# EAGLE design ComponentTester (EAGLE 9.6.2)
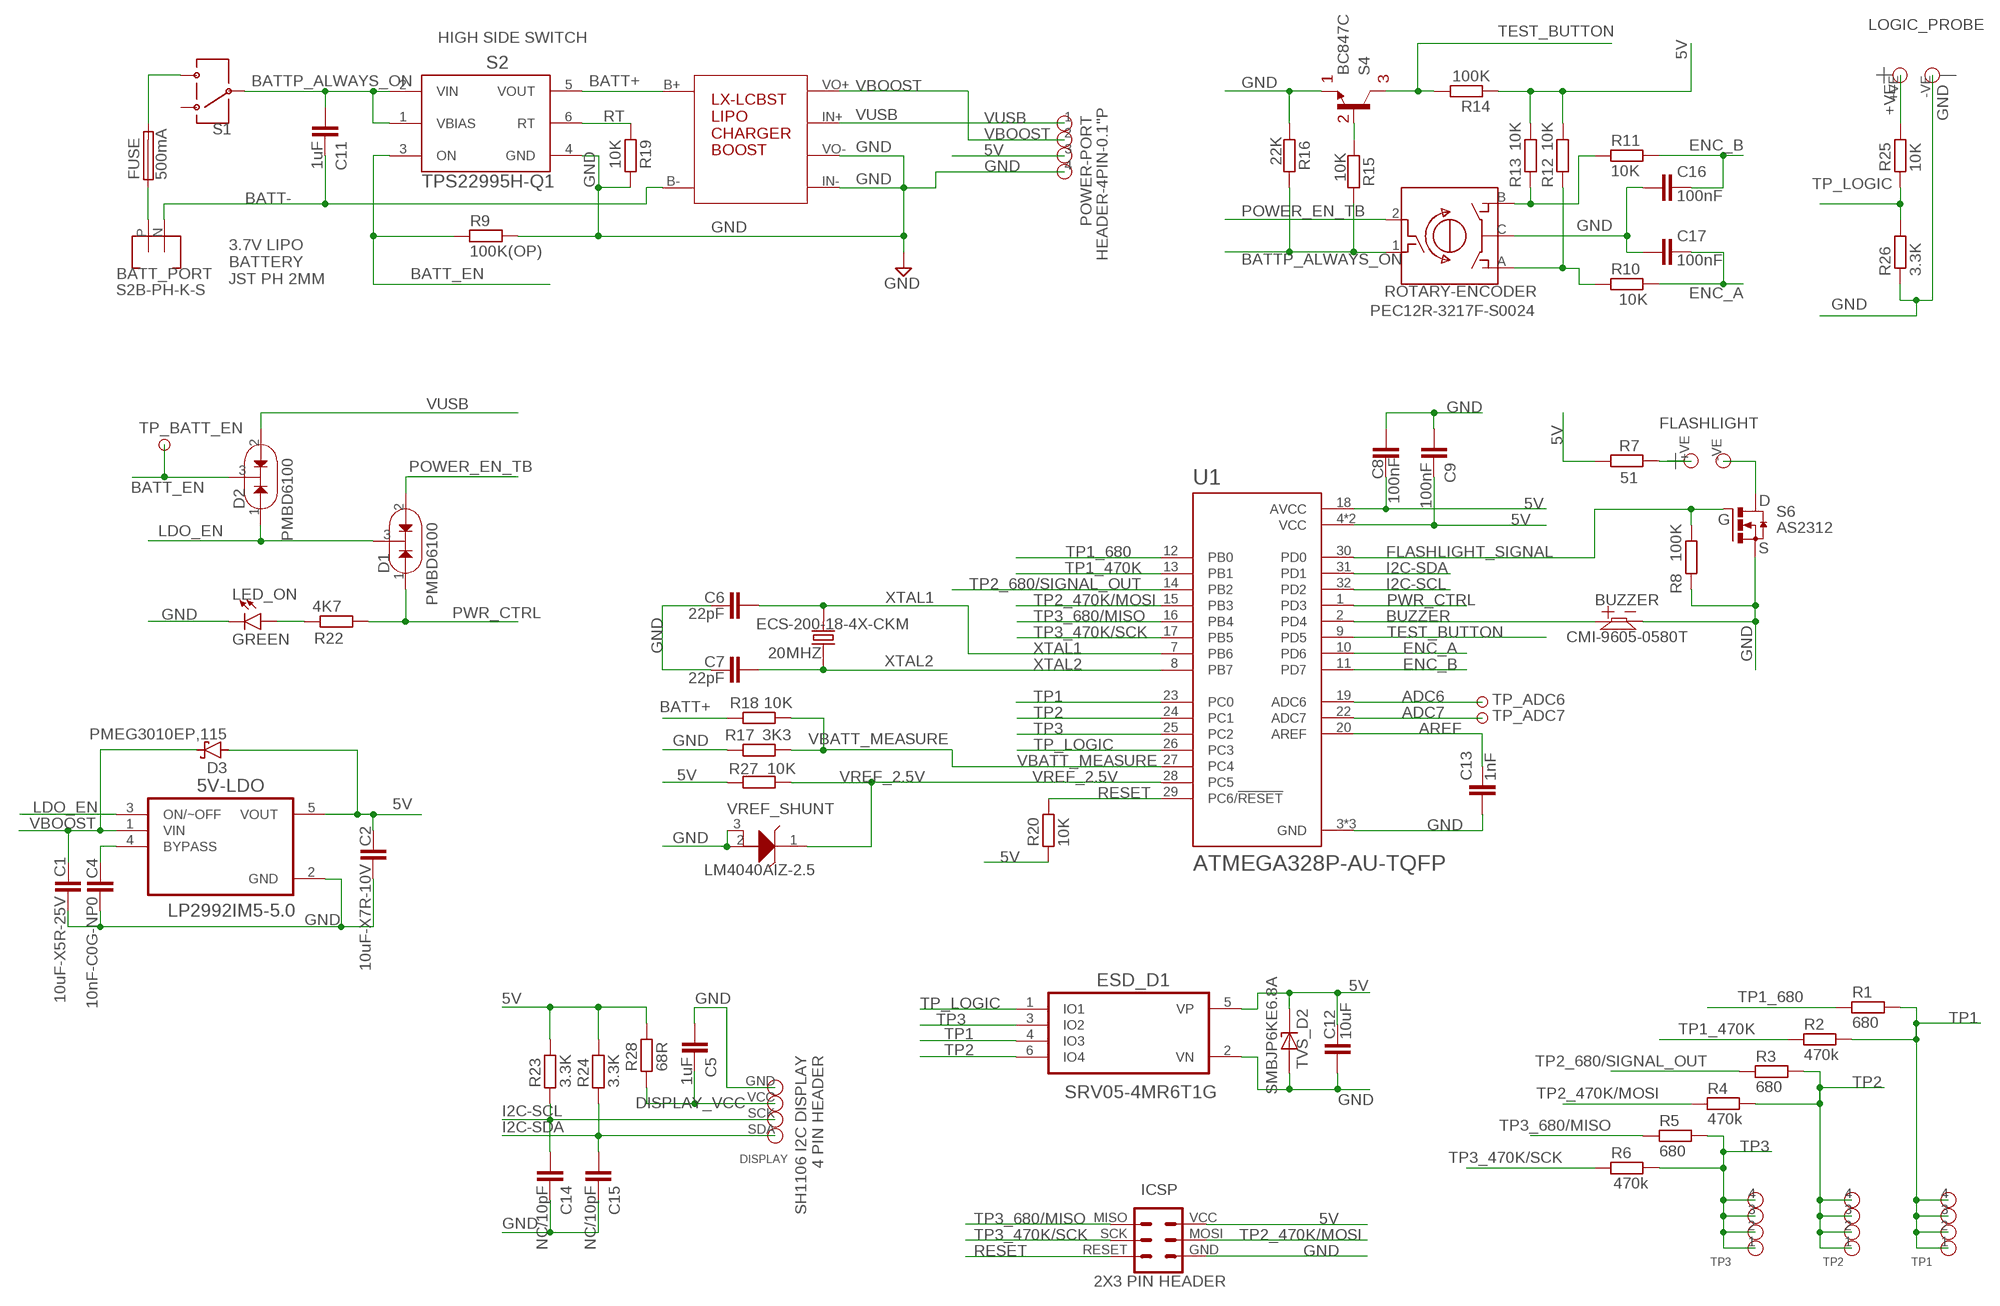
[diagram p0: schematic, sheet 1]

## Parts
5V-LDO  LP2992IM5-5.0  [SOT-23-5]
20MHZ  ECS-200-18-4X-CKM  CRYSTAL-20MHZ-ECS-200-18-4X-CKM  [XTAL_ECS-200-18-4X-CKM]
BATT_PORT  S2B-PH-K-S  [S2B-PH-K-S]
BUZZER  CMI-9605-0580T  BUZZER-ACTIVE-CMI-9605-0580T  [BUZZER-ACTIVE-CMI-9605-0580T]
C1  10uF-X5R-25V  CAPACITOR0603  [0603]
C2  10uF-X7R-10V  CAPACITOR0603  [0603]
C4  10nF-C0G-NP0  CAPACITOR_SMD0603  [0603]
C5  1uF  CAPACITOR_SMD0603  [0603]
C6  22pF  CAPACITOR_SMD0603  [0603]
C7  22pF  CAPACITOR_SMD0603  [0603]
C8  100nF  CAPACITOR_SMD0603  [0603]
C9  100nF  CAPACITOR_SMD0603  [0603]
C11  1uF  CAPACITOR_SMD0603  [0603]
C12  10uF  CAPACITOR_SMD0603  [0603]
C13  1nF  CAPACITOR_SMD0603  [0603]
C14  NC/10pF  CAPACITOR_SMD0603  [0603]
C15  NC/10pF  CAPACITOR_SMD0603  [0603]
C16  100nF  CAPACITOR_SMD0603  [0603]
C17  100nF  CAPACITOR_SMD0603  [0603]
CHARGE_BOOST  BATTERY-CHARGER-BOOST-MODULE-LX-LCBST  [BATTERY-CHARGER-BOOST-MODULE-LX-LCBST]
D1  PMBD6100  DIODE-DOUBLE-COMMON-CATHODE-PMBD6100,215  [SOT-23-3]
D2  PMBD6100  DIODE-DOUBLE-COMMON-CATHODE-PMBD6100,215  [SOT-23-3]
D3  PMEG3010EP,115  DIODE-SCHOTTKY-PMEG3010EP,115  [SOD-128]
DISPLAY  DISPLAY-1.3"-SH1106-I2C  [DISPLAY-1.3"-SH1106-I2C]
ESD_D1  SRV05-4MR6T1G  [SOT-23-6]
FLASHLIGHT  HEADER-2PIN-0.2"P  [HEADER-2PIN-0.2"P]
FUSE  500mA  FUSE  [1206]
ICSP  2X3 PIN HEADER  HEADER-ICSP-0.1"P  [HEADER-ICSP-0.1"P]
LED_ON  GREEN  LED1206  [1206-DIODE]
LOGIC_PROBE  HEADER-2PIN-0.2"P-LOGIC-PROBE  [HEADER-2PIN-0.2"P-LOGIC-PROBE]
POWER-PORT  HEADER-4PIN-0.1"P  [HEADER-4PIN-0.1"P]
R1  680  RESISTOR_SMD1206  [1206]
R2  470k  RESISTOR_SMD1206  [1206]
R3  680  RESISTOR_SMD1206  [1206]
R4  470k  RESISTOR_SMD1206  [1206]
R5  680  RESISTOR_SMD1206  [1206]
R6  470k  RESISTOR_SMD1206  [1206]
R7  51  RESISTOR_SMD1206  [1206]
R8  100K  RESISTOR_SMD0603  [0603]
R9  100K(OP)  RESISTOR_SMD0603  [0603]
R10  10K  RESISTOR_SMD0603  [0603]
R11  10K  RESISTOR_SMD0603  [0603]
R12  10K  RESISTOR_SMD0603  [0603]
R13  10K  RESISTOR_SMD0603  [0603]
R14  100K  RESISTOR_SMD0603  [0603]
R15  10K  RESISTOR_SMD0603  [0603]
R16  22K  RESISTOR_SMD0603  [0603]
R17  3K3  RESISTOR_SMD0603  [0603]
R18  10K  RESISTOR_SMD0603  [0603]
R19  10K  RESISTOR_SMD0603  [0603]
R20  10K  RESISTOR_SMD0603  [0603]
R22  4K7  RESISTOR_SMD0603  [0603]
R23  3.3K  RESISTOR_SMD0603  [0603]
R24  3.3K  RESISTOR_SMD0603  [0603]
R25  10K  RESISTOR_SMD0603  [0603]
R26  3.3K  RESISTOR_SMD0603  [0603]
R27  10K  RESISTOR_SMD0603  [0603]
R28  68R  RESISTOR_SMD0603  [0603]
ROTARY-ENCODER  PEC12R-3217F-S0024  [PEC12R-3217F-S0024]
S1  SLW-913535-2A-RA-D  [SLW-913535-2A-RA-D]
S2  TPS22995H-Q1  [SOT-23-6]
S4  BC847C  [SOT-23-3]
S6  AS2312  AS2312AS2312  [SOT-23-3]
TP1  HEADER-4PIN-0.1"P  [HEADER-4PIN-0.1"P]
TP2  HEADER-4PIN-0.1"P  [HEADER-4PIN-0.1"P]
TP3  HEADER-4PIN-0.1"P  [HEADER-4PIN-0.1"P]
TP_ADC6  TEST-POINT-TH  [TEST-POINT-TH-1MM]
TP_ADC7  TEST-POINT-TH  [TEST-POINT-TH-1MM]
TP_BATT_EN  TEST-POINT-SMD  [TEST-POINT-SMD-1MM]
TVS_D2  SMBJP6KE6.8A  SMBJP6KE6.8A-TP  [DIOM5336X244N]
U1  ATMEGA328P-AU-TQFP  [TQFP32]
VREF_SHUNT  LM4040AIZ-2.5  LM4040AELT-2.5-SOT23  [SOT-23-3]

## Nets
5V: 5V-LDO.5(VOUT) C2.2 C8.2 C9.1 C12.1 D3.A ESD_D1.5(VP) ICSP.VCC POWER-PORT.3 R7.1 R12.2 R13.2 R14.1 R20.1 R23.2 R24.2 R27.1 R28.2 TVS_D2.C U1.4(VCC) U1.6(VCC) U1.18(AVCC)
+VE: LOGIC_PROBE.+VE R25.2
ADC6: TP_ADC6.P$1 U1.19(ADC6)
ADC7: TP_ADC7.P$1 U1.22(ADC7)
AREF: C13.1 U1.20(AREF)
BATT+: CHARGE_BOOST.B+ R18.2 S2.5(VOUT)
BATT+_PORT: BATT_PORT.P FUSE.1
BATT-: BATT_PORT.N C11.1 CHARGE_BOOST.B-
BATT_EN: D2.3(C) R9.1 S2.3(ON) TP_BATT_EN.P$1
BATTP_ALWAYS_ON: C11.2 ROTARY-ENCODER.2 S1.2 S2.1(VBIAS) S2.2(VIN)
BUZZER: BUZZER.P$1 U1.2(PD4)
BYP: 5V-LDO.4(BYPASS) C4.2
DISPLAY_VCC: C5.1 DISPLAY.VCC R28.1
ENC_A: C17.1 R10.2 U1.10(PD6)
ENC_B: C16.1 R11.2 U1.11(PD7)
FLASHLIGHT_SIGNAL: R8.1 S6.1(G) U1.30(PD0)
FUSE_2_SWITCH: FUSE.2 S1.3
GND [New Class]: 5V-LDO.2(GND) BUZZER.P$2 C1.1 C2.1 C4.1 C5.2 C6.1 C7.1 C8.1 C9.2 C12.2 C13.2 C14.1 C15.1 C16.2 C17.2 CHARGE_BOOST.IN-(USB-) CHARGE_BOOST.VO- DISPLAY.GND ESD_D1.2(VN) ICSP.GND LED_ON.C LOGIC_PROBE.-VE POWER-PORT.4 R8.2 R9.2 R16.1 R17.1 R19.2 R26.1 ROTARY-ENCODER.C S2.4(GND) S4.2(E) S6.2(S) TVS_D2.A U1.3(GND) U1.5(GND) U1.21(GND) VREF_SHUNT.2(A) VREF_SHUNT.3(NC/A)
I2C-SCL: C14.2 DISPLAY.SCK R23.1 U1.32(PD2)
I2C-SDA: C15.2 DISPLAY.SDA R24.1 U1.31(PD1)
LDO_EN: 5V-LDO.3(ON/~OFF) D1.3(C) D2.1(A1)
N$1: R11.1 R13.1 ROTARY-ENCODER.B
N$3: FLASHLIGHT.-VE S6.3(D)
N$4: R10.1 R12.1 ROTARY-ENCODER.A
N$5: R15.1 S4.1(B)
N$8: FLASHLIGHT.+VE R7.2
POWER_EN_TB: D1.2(A2) R15.2 R16.2 ROTARY-ENCODER.1
PWR_CTRL: D1.1(A1) R22.2 U1.1(PD3)
RESET: ICSP.RESET R20.2 U1.29(PC6/!RESET)
RT: R19.1 S2.6(RT)
TEST_BUTTON: R14.2 S4.3(C) U1.9(PD5)
TO_LED: LED_ON.A R22.1
TP1: ESD_D1.4(IO3) R1.2 R2.2 TP1.1 TP1.2 TP1.3 TP1.4 U1.23(PC0)
TP1_470K: R2.1 U1.13(PB1)
TP1_680: R1.1 U1.12(PB0)
TP2: ESD_D1.6(IO4) R3.2 R4.2 TP2.1 TP2.2 TP2.3 TP2.4 U1.24(PC1)
TP2_470K/MOSI: ICSP.MOSI R4.1 U1.15(PB3)
TP2_680/SIGNAL_OUT: R3.1 U1.14(PB2)
TP3: ESD_D1.3(IO2) R5.2 R6.2 TP3.1 TP3.2 TP3.3 TP3.4 U1.25(PC2)
TP3_470K/SCK: ICSP.SCK R6.1 U1.17(PB5)
TP3_680/MISO: ICSP.MISO R5.1 U1.16(PB4)
TP_LOGIC: ESD_D1.1(IO1) R25.1 R26.2 U1.26(PC3)
VBATT_MEASURE: R17.2 R18.1 U1.27(PC4)
VBOOST: 5V-LDO.1(VIN) C1.2 CHARGE_BOOST.VO+ D3.K(C) POWER-PORT.2
VREF_2.5V: R27.2 U1.28(PC5) VREF_SHUNT.1(C)
VUSB: CHARGE_BOOST.IN+(USB+) D2.2(A2) POWER-PORT.1
XTAL1: 20MHZ.2 C6.2 U1.7(PB6)
XTAL2: 20MHZ.1 C7.2 U1.8(PB7)
Unconnected: S1.1

## Notes on the sheet
- HIGH SIDE SWITCH
- 3.7V LIPO
  BATTERY
  JST PH 2MM

## Library data of the parts
5V-LDO = .MyComponents:LP2992IM5-5.0: Check availability <https://pricing.snapeda.com/parts/LP2992IM5-5.0/NOPB/Texas%20Instruments/view-part?ref=eda>; AVAILABILITY: In Stock; CHECK_PRICES: https://www.snapeda.com/parts/LP2992IM5-5.0/NOPB/Texas+Instruments/view-part/?ref=eda; DESCRIPTION: 250-mA, 16-V, low-dropout voltage regulator with enable; MF: Texas Instruments; MP: LP2992IM5-5.0/NOPB; PACKAGE: SOT-23-5 Texas Instruments; PRICE: None; PURCHASE-URL: https://www.snapeda.com/api/url_track_click_mouser/?unipart_id=26545&manufacturer=Texas Instruments&part_name=LP2992IM5-5.0/NOPB&search_term=lp2992im5-5.0/nopb; SNAPEDA_LINK: https://www.snapeda.com/parts/LP2992IM5-5.0/NOPB/Texas+Instruments/view-part/?ref=snap
20MHZ = .MyComponents:CRYSTAL-20MHZ-ECS-200-18-4X-CKM: 20MHz Crystal Check availability <https://pricing.snapeda.com/parts/ECS-200-18-4X-CKM/ECS%20Inc./view-part?ref=eda>; AVAILABILITY: In Stock; CHECK_PRICES: https://www.snapeda.com/parts/ECS-200-18-4X-CKM/ECS+Inc./view-part/?ref=eda; DATASHEET: https://ecsxtal.com/store/pdf/hc-49usx.pdf; DESCRIPTION: 20 MHz ±10ppm Crystal 18pF 30 Ohms HC-49/US; MF: ECS Inc.; MP: ECS-200-18-4X-CKM; PACKAGE: HC-49US ECS Inc.; PRICE: None; PURCHASE-URL: https://www.snapeda.com/api/url_track_click_mouser/?unipart_id=5049327&manufacturer=ECS Inc.&part_name=ECS-200-18-4X-CKM&search_term=None; SNAPEDA_LINK: https://www.snapeda.com/parts/ECS-200-18-4X-CKM/ECS+Inc./view-part/?ref=snap
BATT_PORT = .MyComponents:S2B-PH-K-S: S2B-PH-K-S JST 2 PIN CONNECTOR RIGHT ANGLE https://www.digikey.com/en/products/detail/jst-sales-america-inc/S2B-PH-K-S/926626
BUZZER = .MyComponents:BUZZER-ACTIVE-CMI-9605-0580T: Active Buzzer WST-0905T https://www.digikey.com/en/products/detail/soberton-inc/WST-0905T/16354847; DATASHEET: https://www.mouser.com/datasheet/2/670/cmi_9605_0580t-1776530.pdf
C1 C2 = .MyComponents:CAPACITOR0603: capacitor 0603
C4-C9 C11-C17 = .MyComponents:CAPACITOR_SMD: capacitor 1206
CHARGE_BOOST = .MyComponents:BATTERY-CHARGER-BOOST-MODULE-LX-LCBST: LX-LCBST_LIPO_CHARGER_BOOST https://www.aliexpress.us/item/3256805102704359.html
D1 D2 = .MyComponents:DIODE-DOUBLE-COMMON-CATHODE-PMBD6100,215: Dual diode common cathode https://www.mouser.com/ProductDetail/Nexperia/PMBD6100215; DATASHEET: https://www.mouser.com/datasheet/2/916/PMBD6100-2938376.pdf; VALUE: PMBD6100,215
D3 = .MyComponents:DIODE-SCHOTTKY-PMEG3010EP,115: Diode 30 V 1A Surface Mount SOD-128/CFP5 Nexperia USA Inc. https://www.digikey.com/en/products/detail/nexperia-usa-inc/PMEG3010EP-115/2676893
DISPLAY = .MyComponents:DISPLAY-1.3"-SH1106-I2C: SH1106 I2C DISPLAY https://www.amazon.com/dp/B0C3L54TL6
ESD_D1 = .MyComponents:SRV05-4MR6T1G: ESD Circuit Protection 17.5V Clamp 5A (8/20µs) Ipp Tvs Diode Surface Mount 6-TSOP DigiKey <https://www.digikey.com/en/products/detail/onsemi/SRV05-4MR6T1G/2652020> Check availability <https://pricing.snapeda.com/parts/SRV05-4MR6T1G/ON%20Semiconductor/view-part?ref=eda>; AVAILABILITY: In Stock; CHECK_PRICES: https://www.snapeda.com/parts/SRV05-4MR6T1G/Onsemi/view-part/?ref=eda; DESCRIPTION: 17.5V Clamp 5A (8/20µs) Ipp Tvs Diode Surface Mount 6-TSOP; MF: ON Semiconductor; MP: SRV05-4MR6T1G; PACKAGE: TSOP-6 ON Semiconductor; PRICE: None; PURCHASE-URL: https://www.snapeda.com/api/url_track_click_mouser/?unipart_id=95760&manufacturer=ON Semiconductor&part_name=SRV05-4MR6T1G&search_term=None; SNAPEDA_LINK: https://www.snapeda.com/parts/SRV05-4MR6T1G/Onsemi/view-part/?ref=snap
FLASHLIGHT = .MyComponents:HEADER-2PIN-0.2"P: 5MM 2 PIN HEADER
FUSE = .MyComponents:FUSE: FUSE SMD 1206 C1F 250
ICSP = .MyComponents:HEADER-ICSP-0.1"P: ISP HEADER 2X3 2.54MM
LED_ON = .MyComponents:LED
LOGIC_PROBE = .MyComponents:HEADER-2PIN-0.2"P-LOGIC-PROBE: 5MM 2 PIN HEADER
POWER-PORT TP1-TP3 = .MyComponents:HEADER-4PIN-0.1"P: 4 PIN HEADER; LOCATION: <enter>
R1-R20 R22-R28 = .MyComponents:RESISTOR_SMD: resistor smd
ROTARY-ENCODER = .MyComponents:PEC12R-3217F-S0024: Rotary Encoder with Push Button and Bushing Bourns Inc digikey <https://www.digikey.com/en/products/detail/bourns-inc/PEC12R-3217F-S0024/6153383>
S1 = .MyComponents:SLW-913535-2A-RA-D: spdt slide switch
S2 = .MyComponents:TPS22995H-Q1: Power Switch/Driver 1:1 N-Channel 3A SOT-23-THIN DigiKey <https://www.digikey.com/en/products/detail/texas-instruments/TPS22995HQDDCRQ1/17394924>
S4 = .MyComponents:BC847C: BC847C Bipolar (BJT) Transistor NPN 45 V 100 mA 300MHz 200 mW Surface Mount SOT-23 https://www.digikey.com/en/products/detail/good-ark-semiconductor/BC847C/18648944
S6 = .MyComponents:AS2312: AS2312 N-Channel 20 V 6.8A (Ta) 1.2W (Ta) Surface Mount SOT-23 https://www.digikey.com/en/products/detail/anbon-semiconductor-int-l-limited/AS2312/16708465
TP_ADC6 TP_ADC7 TP_BATT_EN = .MyComponents:TEST-POINT: TEST POINT
TVS_D2 = .MyComponents:SMBJP6KE6.8A-TP: SMBJ Series 600 W 6.8 V Uni-Directional Surface Mount TVS Diode - SMB; CHECK_PRICES: https://www.snapeda.com/parts/SMBJP6KE6.8A-TP/Micro+Commercial+Components/view-part/?ref=eda; DESCRIPTION: 10.5V Clamp 58.1A Ipp Tvs Diode Surface Mount DO-214AA (SMBJ); DIGIKEY_PART_NUMBER: SMBJP6KE6.8A-TPMSTR-ND; MF: Micro Commercial; MP: SMBJP6KE6.8A-TP; PACKAGE: DO-214 MCC; PURCHASE-URL: https://www.snapeda.com/api/url_track_click_mouser/?unipart_id=577204&manufacturer=Micro Commercial&part_name=SMBJP6KE6.8A-TP&search_term=smbjp6ke6.8a; SNAPEDA_LINK: https://www.snapeda.com/parts/SMBJP6KE6.8A-TP/Micro+Commercial+Components/view-part/?ref=snap
U1 = .MyComponents:ATMEGA328P-AU-TQFP: Check availability <https://pricing.snapeda.com/parts/ATMEGA328P-AU/Microchip/view-part?ref=eda>; AVAILABILITY: In Stock; CHECK_PRICES: https://www.snapeda.com/parts/ATMEGA328P-AU/Microchip/view-part/?ref=eda; DESCRIPTION: AVR AVR® ATmega Microcontroller IC 8-Bit 20MHz 32KB (16K x 16) FLASH 32-TQFP (7x7); MF: Microchip; MP: ATMEGA328P-AU; PACKAGE: TQFP-32 Microchip; PRICE: None; PURCHASE-URL: https://www.snapeda.com/api/url_track_click_mouser/?unipart_id=44280&manufacturer=Microchip&part_name=ATMEGA328P-AU&search_term=atmega328p-au; SNAPEDA_LINK: https://www.snapeda.com/parts/ATMEGA328P-AU/Microchip/view-part/?ref=snap
VREF_SHUNT = .MyComponents:LM4040AELT-2.5-SOT23: STMicroelectronics Shunt Voltage Reference IC Fixed 2.5V V ±0.1% 15 mA SOT-23-3 https://www.digikey.com/en/products/detail/stmicroelectronics/LM4040AELT-2-5/16184070 https://www.mouser.com/ProductDetail/511-LM4040AELT-2.5; DATASHEET: https://www.st.com/resource/en/datasheet/lm4040.pdf

## Net classes
0 default: clearance 0.205 mm

## Board
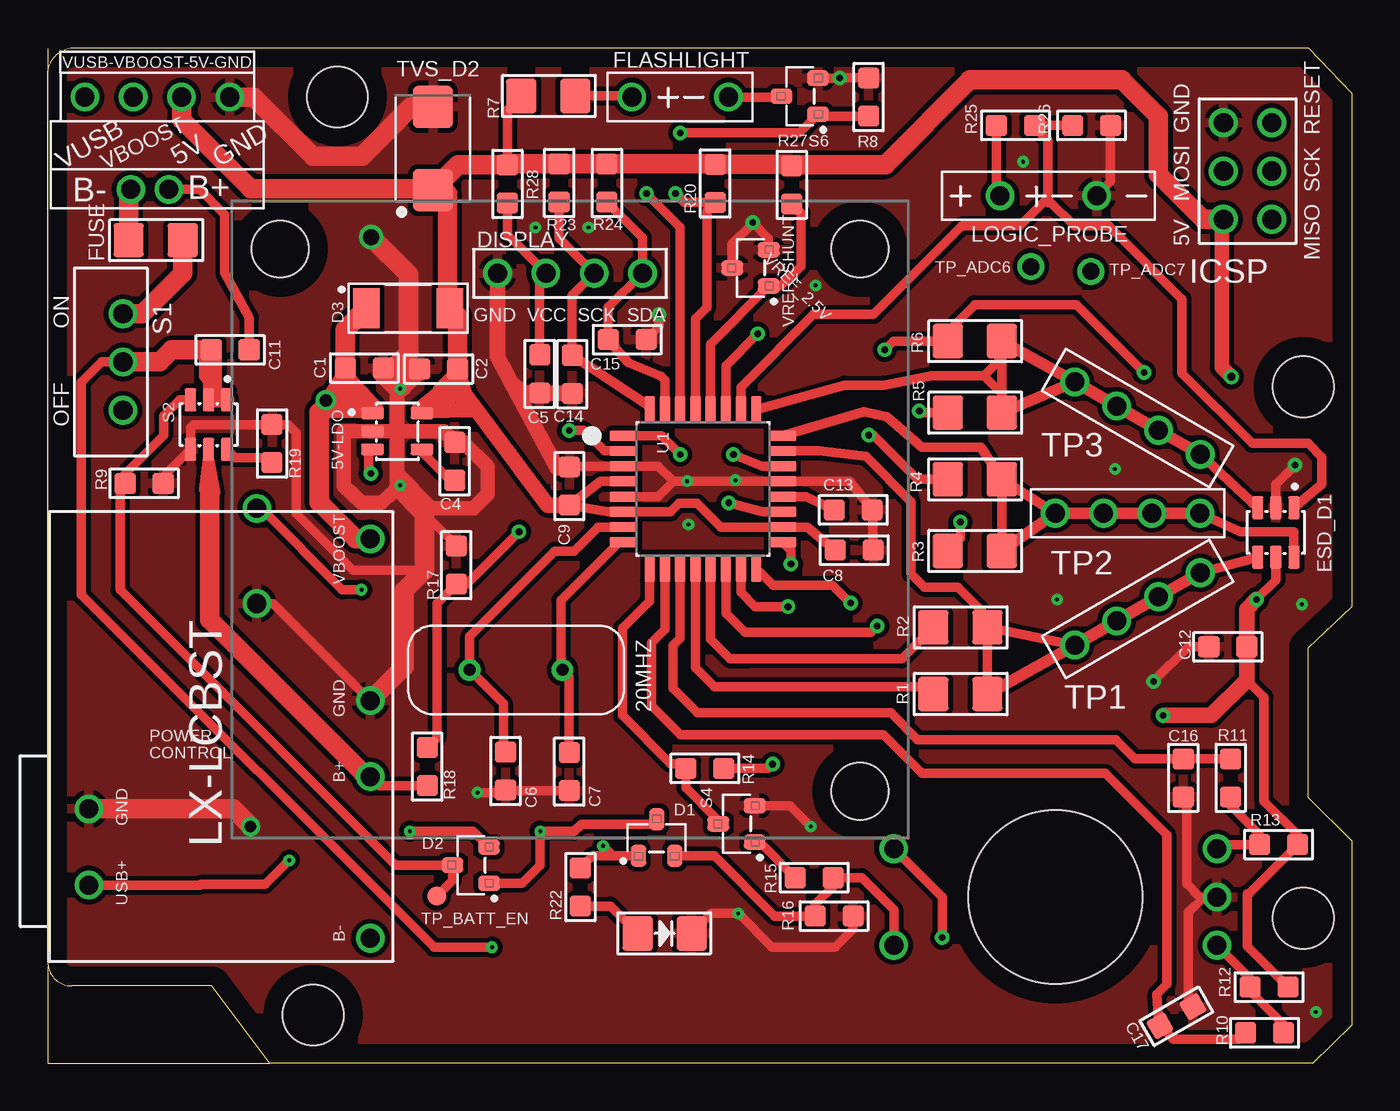
[diagram p1: board, top side]
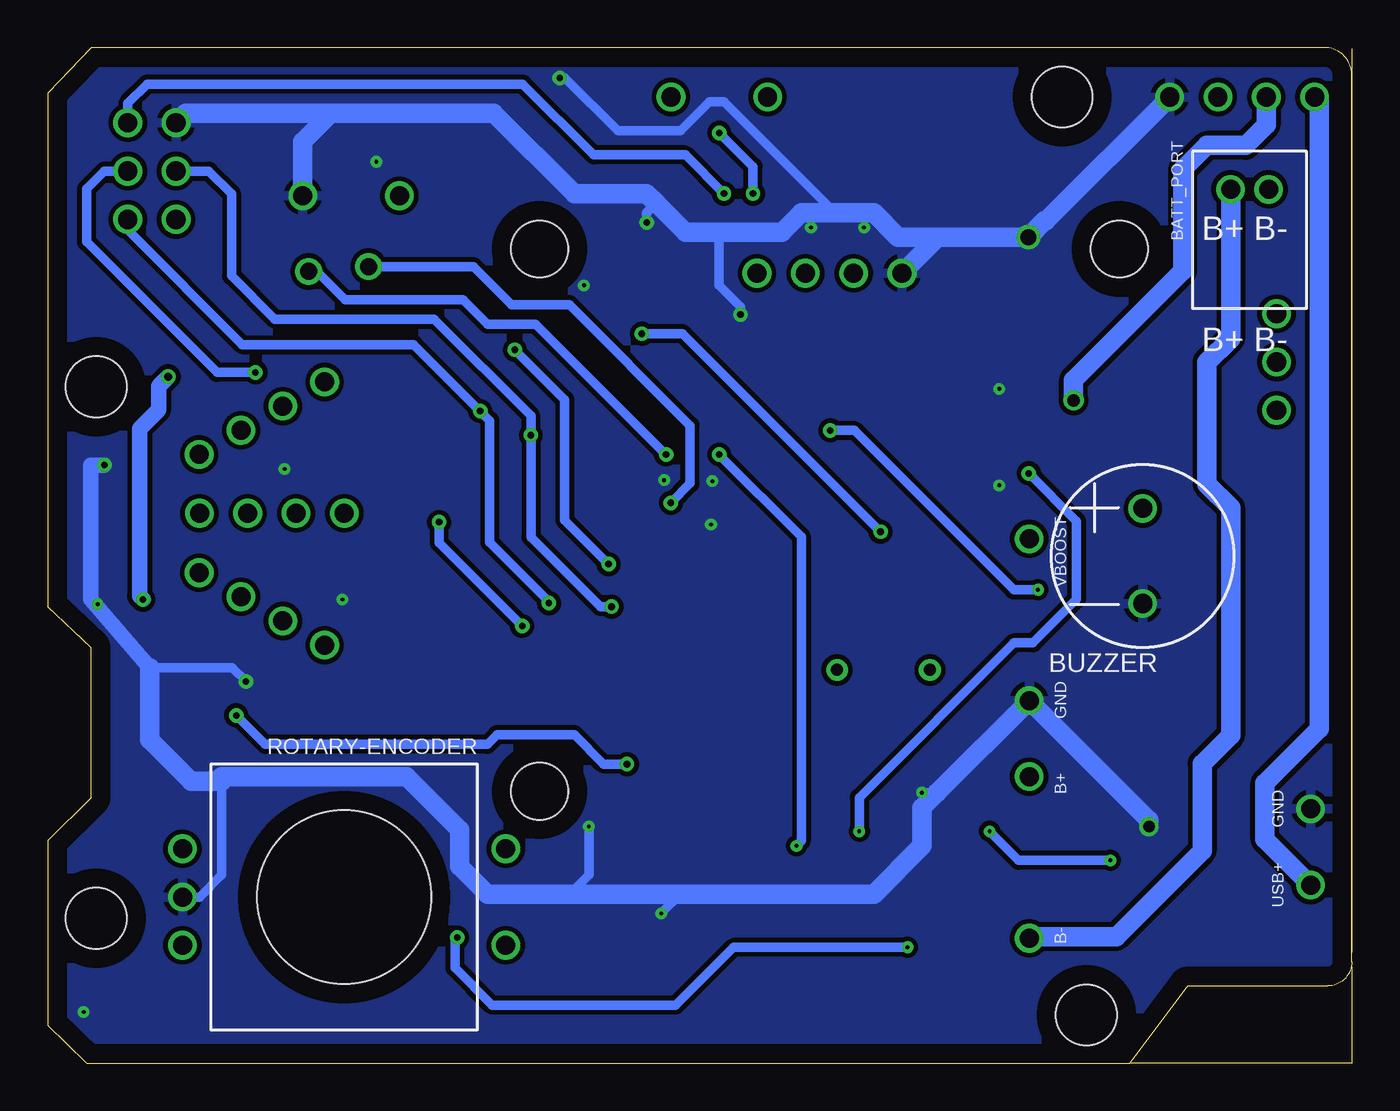
[diagram p2: board, bottom side, seen from below]

Size 68.61 x 53.4 mm. Coordinates in mm from the lower left corner, seen from the top.
Outline: 11.69,0 0.01,0 0.01,4.83 0.01,5.08
Outline: 0.01,53.34 0.01,53.09 0.01,52.07 0.01,51.82
Outline: 0.01,51.82 0.01,51.31 0.01,5.84
Outline: 0.01,51.82 0.01,5.33 arc90 1.28,4.06 8.64,4.06 11.69,0
Outline: 11.69,0 66.55,0 68.61,2 68.61,11.7 66.3,13.97 66.3,21.84 68.61,24 68.61,51 66.31,53.4 1.51,53.4 arc98 0.01,51.82
Copper layers (1*16): Top 0.035mm / dielectric 1.5mm / Bottom 0.035mm
Design rules "default *": minimum track width 0.5mm, minimum drill 0.2mm, track to track 0.25mm, track to pad 0.25mm, pad to pad 0.25mm, via to via 0.25mm, smd to smd 6mil, copper to edge 1mm, drill to drill 0.5mm, minimum pad ring 10mil, minimum via ring 8mil, stop-mask expansion 0.25mm, vias tented up to drill 0mil, thermal gap 10mil
Holes 3.2 mm at 13.98,2.54 66.05,7.62 66.05,35.56 15.25,50.8
tKeepout: area 64,5.6 to 68,9.6; area 64,33.6 to 68,37.6; area 12,0.5 to 16,4.5; area 13.2,48.8 to 17.2,52.8
bKeepout: area 64,33.6 to 68,37.6; area 64,5.6 to 68,9.6; area 12,0.5 to 16,4.5; area 13.2,48.8 to 17.2,52.8

### Footprints (pad centres in the part's own frame; a part is rotated, then mirrored left to right if it is on the bottom)
SOT-23-5 = smd 1.2 x 0.6: 1 -1.3,0.95; 2 -1.3,0; 3 -1.3,-0.95; 4 1.3,-0.95; 5 1.3,0.95
XTAL_ECS-200-18-4X-CKM = drill 0.63 pad 1.03: 1 -2.44,0; 2 2.44,0
S2B-PH-K-S = drill 1: N 0.984,-2.54; P -1.016,-2.54
BUZZER-ACTIVE-CMI-9605-0580T = drill 1: P$1 0,2.5; P$2 0,-2.5
0603 = smd 1.1 x 1.1: 1 -1,0; 2 1,0
BATTERY-CHARGER-BOOST-MODULE-LX-LCBST = drill 1: B+ -1.73,-7.69; B- -10.23,-7.69; IN+ -7.43,7.11; IN- -3.43,7.11; VO+ 10.77,-7.69; VO- 2.27,-7.69
SOT-23-3 = smd 0.8 x 1.13: 1 -0.95,-0.96; 2 0.95,-0.96; 3 0,0.96
SOD-128 = smd 1.4 x 2.1: A 2.11,0.06; K -2.29,0.06
DISPLAY-1.3"-SH1106-I2C = drill 1: GND -3.81,-1.27; SCK 1.27,-1.27; SDA 3.81,-1.27; VCC -1.27,-1.27 | hole 3: -15.24,0; 15.24,0; 15.24,-28.5
SOT-23-6 = smd 1.2 x 0.6: 1 -1.3,0.95; 2 -1.3,0; 3 -1.3,-0.95; 4 1.3,-0.95; 5 1.3,0; 6 1.3,0.95
HEADER-2PIN-0.2"P = drill 1: +VE -2.54,0; -VE 2.54,0
1206 = smd 1.6 x 1.803: 1 -1.422,0; 2 1.422,0
HEADER-ICSP-0.1"P = drill 1.016: GND 2.54,1.27; MISO -2.54,-1.27; MOSI 0,1.27; RESET 2.54,-1.27; SCK 0,-1.27; VCC -2.54,1.27
1206-DIODE = smd 1.6 x 1.803: A 1.422,0; C -1.422,0
HEADER-2PIN-0.2"P-LOGIC-PROBE = drill 1: +VE -2.54,0; -VE 2.54,0
HEADER-4PIN-0.1"P = drill 1: 1 -3.81,0; 2 -1.27,0; 3 1.27,0; 4 3.81,0
PEC12R-3217F-S0024 = drill 1: 1 -2.54,8.5; 2 2.54,8.5; A -2.54,-8.5; B 2.54,-8.5; C 0,-8.5 | hole 9.144: 0,0
SLW-913535-2A-RA-D = drill 1: 1 -2.54,0; 2 0,0; 3 2.54,0
TEST-POINT-TH-1MM = drill 0.9: P$1 0,0
TEST-POINT-SMD-1MM = smd 1 x 1: P$1 0,0
DIOM5336X244N = smd 2.22 x 2.13: A 2.19,0; C -2.19,0
TQFP32 = smd 1.47 x 0.55: 1 -4.17,2.8; 2 -4.17,2; 3 -4.17,1.2; 4 -4.17,0.4; 5 -4.17,-0.4; 6 -4.17,-1.2; 7 -4.17,-2; 8 -4.17,-2.8; 17 4.17,-2.8; 18 4.17,-2; 19 4.17,-1.2; 20 4.17,-0.4; 21 4.17,0.4; 22 4.17,1.2; 23 4.17,2; 24 4.17,2.8 | smd 0.55 x 1.47: 9 -2.8,-4.17; 10 -2,-4.17; 11 -1.2,-4.17; 12 -0.4,-4.17; 13 0.4,-4.17; 14 1.2,-4.17; 15 2,-4.17; 16 2.8,-4.17; 25 2.8,4.17; 26 2,4.17; 27 1.2,4.17; 28 0.4,4.17; 29 -0.4,4.17; 30 -1.2,4.17; 31 -2,4.17; 32 -2.8,4.17

### Placement (x,y rotation side)
5V-LDO  18.4,33.22 0 top
20MHZ  24.64,20.68 180 top
BATT_PORT  5.4,43.4 180 bottom
BUZZER  11.01,26.67 0 bottom
C1  16.66,36.55 180 top
C2  20.57,36.49 0 top
C4  21.42,31.65 270 top
C5  25.89,36.25 270 top
C6  24.09,15.36 90 top
C7  27.44,15.33 90 top
C8  42.43,26.98 180 top
C9  27.44,30.34 90 top
C11  9.61,37.51 180 top
C12  62.08,21.89 180 top
C13  42.38,29.09 0 top
C14  27.59,36.22 90 top
C15  30.49,38.05 180 top
C16  59.74,15 270 top
C17  59.38,2.46 30 top
CHARGE_BOOST  9.29,16.8 90 top
D1  32.04,11.87 0 top
D2  22.25,10.42 90 top
D3  19.06,39.62 0 top
DISPLAY  27.48,42.81 0 top
ESD_D1  64.6,27.91 270 top
FLASHLIGHT  33.27,50.8 0 top
FUSE  5.69,43.28 0 top
ICSP  63.12,46.91 90 top
LED_ON  32.46,6.82 180 top
LOGIC_PROBE  52.64,45.61 0 top
POWER-PORT  5.78,50.8 0 top
R1  48.01,19.41 0 top
R2  48.01,22.92 0 top
R3  48.77,26.94 0 top
R4  48.77,30.7 0 top
R5  48.77,34.21 0 top
R6  48.77,37.97 0 top
R7  26.33,50.86 0 top
R8  43.19,50.8 90 top
R9  5.09,30.48 0 top
R10  64.01,1.6 180 top
R11  62.23,15 90 top
R12  64.24,4 0 top
R13  64.75,11.49 0 top
R14  34.57,15.5 180 top
R15  40.32,9.75 0 top
R16  41.37,7.74 180 top
R17  21.49,26.19 270 top
R18  19.97,15.6 270 top
R19  11.8,32.58 90 top
R20  35.11,46.25 270 top
R22  28.03,9.26 90 top
R23  26.9,46.28 90 top
R24  29.42,46.28 90 top
R25  50.91,49.31 180 top
R26  54.91,49.31 180 top
R27  39.15,46.18 270 top
R28  24.19,46.23 90 top
ROTARY-ENCODER  53.01,8.74 90 top
S1  3.97,36.87 90 top
S2  8.47,33.57 270 top
S4  36.23,12.58 90 top
S6  39.56,50.84 90 top
TP1  57.33,23.89 210 top
TP2  56.81,28.91 180 top
TP3  57.33,33.91 150 top
TP_ADC6  51.72,41.88 0 top
TP_ADC7  54.87,41.63 0 top
TP_BATT_EN  20.46,8.79 0 top
TVS_D2  20.27,48.09 90 top
U1  34.47,30.19 0 top
VREF_SHUNT  36.97,41.81 90 top

### Tracks (layer width: path | path; a pad name or v marks a point on that pad's centre or on a via)
5V  (via drill 0.35, 0.4)
  Top 0.508: v38.13,15.72 37.91,15.5 R14.1 | 63.08,20.14 63.97,19.25 63.97,13.78 65.75,12 R13.2 63.17,8.91 63.09,8.91 63.09,6.15 R12.2 | R7.1 24.19,50.13 R28.2 | ESD_D1.5 64.6,25.4 v63.59,24.38 | C8.2 39.98,28.17 38.66,28.17 U1.18 35.41,28.19 34.17,29.44 33.22,29.44 32.77,28.99 U1.6 29.47,28.99 C9.1 29.07,30.59 U1.4 | 5V-LDO.5 19.8,34.3 19.88,34.4 20.65,35.36 20.91,35.68 19.35,34.41 19.58,34.17 5V-LDO.5
  Top 0.762: ICSP.VCC 61.75,44.27 61.75,36.6 v62.26,36.09
  Top 0.813: R28.2 24.24,47.28 | 35.08,47.28 R20.1 | 39.07,47.25 R27.1 | C9.1 26.29,29.34 21.96,35.16 | 22.08,34.73 22.44,34.37 19.8,34.3 | 22.08,34.73 21.57,35.24 | 21.57,35.24 C2.2 | 21.57,35.24 19.88,34.4 | C2.2 21.57,36.27 20.65,35.36 | C2.2 21.96,35.16 | 21.96,35.16 22.08,34.73 | v63.59,24.38 63.08,23.88 C12.1 63.08,20.14 61.22,18.29 v58.68,18.29
  Top 1.016: TVS_D2.C 21.59,47.23 R28.2 | 24.24,47.28 R23.2 R24.2 35.08,47.28 | R20.1 39.07,47.25 | R27.1 39.21,47.24 44.07,47.24 48.52,51.7 56.51,51.7 58.43,49.78 58.43,46.74 60.79,44.37 ICSP.VCC | TVS_D2.C 20.27,45.72 21.03,45.72 21.03,39.82 D3.A 21.57,39.28 C2.2 | POWER-PORT.3 7.05,49.6 10.67,45.97 20.19,45.97 TVS_D2.C
  Bottom 0.508: v38.13,15.72 39.35,15.72 40.9,17.27 44.96,17.27 45.47,16.76 57.16,16.76 v58.68,18.29
  Bottom 0.813: v62.26,36.09 62.77,35.59 62.77,34.36 63.76,33.37 63.76,24.56 v63.59,24.38
+VE
  Top 0.508: R25.2 49.91,45.8 LOGIC_PROBE.+VE
ADC6  (via drill 0.35)
  Top 0.508: v35.82,29.46 37.6,28.99 U1.19
  Bottom 0.508: v35.82,29.46 34.8,30.48 34.8,33.53 41.15,39.88 44.2,39.88 46.21,41.88 TP_ADC6.P$1
ADC7  (via drill 0.35)
  Top 0.508: v36.07,32 37.6,31.39 U1.22
  Bottom 0.508: TP_ADC7.P$1 54.46,41.63 52.97,40.13 46.74,40.13 45.47,38.86 42.93,38.86 v36.07,32
AREF
  Top 0.508: U1.20 39.88,29.79 C13.1
BATT+
  Top 0.508: 8.21,30.14 S2.5 8.47,31.98 8.84,29.99 8.52,30.05 | CHARGE_BOOST.B+ 17.45,14.6 R18.2
  Top 1.016: CHARGE_BOOST.B+ 16.8,15.24 16.59,15.24 8.52,23.32 8.52,30.05
BATT+_PORT
  Top 1.016: BATT_PORT.P 4.27,45.82 FUSE.1
BATT-
  Top 0.508: BATT_PORT.N 8.01,45.94 9.33,44.62 9.33,41.56 10.61,39.2 C11.1
  Bottom 1.016: BATT_PORT.N 6.38,38.1 7.63,36.86 7.63,30.45 6.38,29.21 6.38,17.24 7.88,15.75 7.88,11.18 12.4,6.65 16.98,6.65 CHARGE_BOOST.B-
BATT_EN
  Top 0.508: S2.3 6.94,34.87 6.1,34.04 6.1,33.02 3.82,30.73 | TP_BATT_EN.P$1 21.29,9.62 D2.3 18.29,10.41 3.82,24.89 3.82,30.73 | R9.1 3.83,30.73 3.82,30.73
BATTP_ALWAYS_ON  (via drill 0.2, 0.35)
  Top 0.508: S1.2 2.84,36.87 1.78,35.81 1.78,24.64 20.33,6.1 v23.37,6.1 | v47.06,6.6 47.06,8.73 ROTARY-ENCODER.2
  Top 0.61: S2.2 8.47,35.92 8.26,36.12 8.26,37.16 C11.2
  Top 0.813: C11.2 8.76,37.36 8.76,34.87 S2.1
  Top 1.016: S1.2 5.89,36.87 6.53,37.51 C11.2
  Bottom 0.508: v23.37,6.1 32.52,6.1 35.57,3.05 45.22,3.05 47.18,5.01 47.18,6.6 v47.06,6.6
BUZZER  (via drill 0.2, 0.35)
  Top 0.508: v27.44,33.27 28.2,33.27 29.28,32.19 U1.2 | v16.52,24.89 15.5,24.89 11.22,29.17 BUZZER.P$1
  Bottom 0.508: v16.52,24.89 17.79,24.89 26.17,33.27 v27.44,33.27
BYP
  Top 0.508: C4.2 21.17,30.65 19.7,32.13 5V-LDO.4
DISPLAY_VCC
  Top 0.508: C5.1 25.89,41.22 DISPLAY.VCC 24.19,43.56 R28.1
ENC_A
  Top 0.508: U1.10 32.47,22.81 31.76,22.1 31.76,18.8 33.29,17.27 43.96,17.27 45.98,15.24 55.63,15.24 58.86,12.01 58.86,4.15 58.35,3.63 58.46,2.02 C17.1 59.21,1.27 62.68,1.27 R10.2
ENC_B
  Top 0.508: R11.2 C16.1 57.2,16 56.18,17.02 47.5,17.02 45.75,17.02 44.35,18.41 34.19,18.41 32.9,19.71 32.9,21.97 33.27,22.34 U1.11
FLASHLIGHT_SIGNAL  (via drill 0.35)
  Top 0.508: U1.30 33.27,43.95 v31.5,45.72 | v33.28,48.91 39.54,48.91 S6.1 40.61,49.8 R8.1
  Bottom 0.508: v31.5,45.72 31.5,47.14 v33.28,48.91
FUSE_2_SWITCH
  Top 1.016: FUSE.2 7.11,41.54 4.98,39.41 S1.3
GND  (via drill 0.2, 0.35, 0.6, 0.85)
  Top 0.508: C9.2 27.49,31.39 27.5,31.39 U1.3 32.12,31.39 32.92,30.59 | VREF_SHUNT.2 37.93,43.36 v37.09,44.2 37.09,44.16 36.01,43.08 VREF_SHUNT.3 | v32.16,39.37 32.16,38.73 C15.1 | 32.92,30.59 U1.21 42.19,30.59 C13.2 C8.1 | U1.5 32.12,29.79 32.92,30.59 | v65.61,31.45 64.6,30.43 ESD_D1.2 | S6.2 v41.66,51.79 v41.67,51.8 R8.2 | C17.2 60,3.21 60,7.92 60.81,8.74 ROTARY-ENCODER.C 60.61,8.74 59.91,9.43 59.91,13.82 C16.2 | v58.17,20.07 59.99,21.89 C12.2 | R26.1 55.91,46.33 LOGIC_PROBE.-VE | BUZZER.P$2 11.87,24.17 CHARGE_BOOST.VO- | 19.83,25.92 16.08,25.92 13.09,28.91 13.09,33.15 12.65,33.58 R19.2 7.68,33.58 7.52,33.42 S2.4 6.09,30.84 R9.2 | C7.1 24.12,14.33 | 24.12,14.33 C6.1 | R17.1 21.49,27.23 19.83,28.9 | v22.61,14.22 24.01,14.22 24.12,14.33 | v40.14,12.45 39.05,13.53 S4.2 | LED_ON.C 34.93,7.87 v36.33,7.87 38.11,6.1 41.41,6.1 42.37,7.05 R16.1
  Top 0.61: C1.1 18.4,35.32 | 18.4,33.22 18.4,33.2 | 18.4,30.35 18.45,30.28
  Top 0.762: C1.1 17.48,36.37 17.48,36.24 18.4,35.32 18.4,33.22 | 5V-LDO.2 18.4,33.22 | 18.4,33.2 18.4,30.35 | 18.45,30.28 17.53,29.46 16.52,29.46 15.58,30.36 15.58,33.22 5V-LDO.2 | 5V-LDO.2 18.39,33.22 18.39,30.98 20.19,29.19 22.4,29.19 23.13,29.92 23.13,31.38 21.87,32.65 | 18.4,33.22 20.84,33.22 C4.1
  Top 0.813: DISPLAY.GND 23.68,41.53 23.68,37.14 24.39,35.81 | 24.39,35.81 24.96,35.25 C5.2 25.91,35.22 C14.1 | 24.39,35.81 26.8,31.32 C9.2 | C4.1 21.87,32.65
  Top 1.016: POWER-PORT.4 10.85,50.8 13.96,47.69 16.53,47.69 19.12,50.28 TVS_D2.A | C1.1 17.92,36.28 | 17.92,36.28 18.64,35.56 C2.1 | 17.92,36.28 18.98,37.34 18.98,41.48 v17.02,43.43 | CHARGE_BOOST.VO- 18.75,20.85 18.75,24.84 19.83,25.92 19.83,28.9 18.45,30.28 | CHARGE_BOOST.IN- 9.75,13.37 v10.67,12.45
  Bottom 0.508: 36.58,45.21 37.09,44.7 v37.09,44.2 | 33.28,43.69 33.28,40.89 32.16,39.78 v32.16,39.37 | v41.66,51.79 41.66,51.82 41.41,51.82 38.61,49.02 35.31,49.02 33.79,50.55 33.03,50.55 27.44,44.96 27.44,44.7 | 21.82,14.22 v22.61,14.22 | ROTARY-ENCODER.C 60.61,8.74 59.44,9.91 59.44,14.82 59.44,15.07 | v58.17,20.07 58.89,20.79 63.23,20.79 | 41.15,8.89 40.14,9.91 v40.14,12.45 | 33.03,8.89 35.31,8.89 v36.33,7.87
  Bottom 0.813: v65.61,31.45 66.34,31.45 66.34,24.38 63.23,20.79
  Bottom 1.016: 21.77,43.43 v17.02,43.43 16.17,44.29 16.1,44.29 POWER-PORT.4 | 53.68,49.96 45.14,49.96 40.9,45.72 37.09,45.72 36.58,45.21 35.06,43.69 33.28,43.69 29.98,43.69 28.96,44.7 27.44,44.7 25.15,44.7 23.88,43.43 21.77,43.43 | 53.68,49.96 61.34,49.96 ICSP.GND | LOGIC_PROBE.-VE 55.18,48.46 53.68,49.96 | 63.23,20.79 63.23,17 61.05,14.82 59.44,14.82 | 21.77,43.43 DISPLAY.GND | v10.67,12.45 10.67,12.77 CHARGE_BOOST.VO- 21.82,14.22 22.61,13.43 22.61,11.43 25.15,8.89 33.03,8.89 41.15,8.89 45.47,8.89 46.93,10.34 46.93,12.27 49.73,15.07 59.44,15.07
  other vias: 18.55,30.38 33.64,30.61 36.18,30.66 56.14,31.24 53.09,24.38 40.39,40.89 25.66,43.94 28.45,43.94 33.71,28.32 18.55,35.46 65.97,24.13 66.71,2.69 51.31,47.4
  pour Bottom: -6.59,58.67 -7.62,-5.59 75.44,-5.59 73.9,59.18
  pour Top: -6.6,58.39 -6.85,-7.37 75.44,-6.1 74.94,60.68
I2C-SCL
  Top 0.508: U1.32 31.67,34.54 C14.2 27.59,40.38 DISPLAY.SCK 26.91,43.38 R23.1
I2C-SDA
  Top 0.508: U1.31 32.47,34.38 32.48,34.39 32.47,34.42 32.47,35.91 32.26,36.12 30.56,36.83 C15.2 29.49,39.73 DISPLAY.SDA 31.29,43.41 R24.1
LDO_EN  (via drill 0.2, 0.35)
  Top 0.508: v17,31.01 16.9,31.11 16.89,32.07 5V-LDO.3 | D2.1 24.97,9.47 25.91,10.41 v25.91,12.19 27.69,12.19 28.07,12.57 31.78,12.57 D1.3
  Bottom 0.508: v17,31.01 14.48,28.5 14.48,24.38 16.77,22.1 17.79,22.1 25.91,13.97 v25.91,12.19
N$1
  Top 0.508: R11.1 62.23,13.52 63.75,12 R13.1 61.72,11.49 ROTARY-ENCODER.B
N$3
  Top 0.508: FLASHLIGHT.-VE 38.56,50.8 S6.3
N$4
  Top 0.508: R10.1 65.01,2.06 63.24,3.82 R12.1 63.24,4.46 ROTARY-ENCODER.A
N$5
  Top 0.508: R15.1 37.44,11.63 S4.1
N$8
  Top 0.508: R7.2 30.68,50.86 FLASHLIGHT.+VE
POWER_EN_TB
  Top 0.508: D1.2 35.07,10.91 38.24,7.74 R16.2 40.37,8.36 41.32,9.31 R15.2 42.83,9.75 44.51,8.08 ROTARY-ENCODER.1
PWR_CTRL  (via drill 0.2, 0.35)
  Top 0.508: v33.28,32 32.29,32.99 U1.1 | R22.2 28.67,10.91 D1.1 29.74,10.91 v29.22,11.43
  Bottom 0.508: v33.28,32 28.96,27.69 28.96,11.68 v29.22,11.43
RESET  (via drill 0.35)
  Top 0.508: U1.29 34.07,39.15 34.68,39.76 34.68,44.83 R20.2 33.49,45.25 v33.03,45.72
  Bottom 0.508: v33.03,45.72 35.06,47.75 39.88,47.75 43.61,51.48 63.37,51.48 64.39,50.46 ICSP.RESET
RT
  Top 0.508: S2.6 9.86,31.83 11.55,31.83 R19.1
TEST_BUTTON
  Top 0.508: U1.9 31.67,24.3 30.23,22.86 30.23,18.29 32.77,15.75 33.32,15.75 R14.2 33.57,14.48 35.27,12.78 S4.3
TO_LED
  Top 0.508: R22.1 29.6,8.26 LED_ON.A
TP1
  Top 0.508: R2.2 49.43,23.48 47.87,25.03 46.12,25.03 45.42,25.73 45.42,29.52 43.03,31.9 40.57,32.19 U1.23 | R2.2 R1.2 | R2.2 TP1.4 | TP1.1 ESD_D1.4
  Top 0.61: R1.2 TP1.4 TP1.3 TP1.2 TP1.1
TP1_470K
  Top 0.508: U1.13 34.87,22.89 34.87,22.28 35.9,21.26 36.51,21.26 36.84,21.26 44.92,21.26 R2.1
TP1_680
  Top 0.508: U1.12 34.07,20.8 35.08,19.79 46.21,19.79 R1.1
TP2
  Top 0.508: R4.2 49.08,32.38 45.98,32.38 44.15,33.98 42.93,34.26 U1.24 | R4.2 TP2.4 | R3.2 R4.2 | TP2.1 62.74,27.94 65.55,27.94 ESD_D1.6
  Top 0.61: R3.2 TP2.4 TP2.3 TP2.2 TP2.1
TP2_470K/MOSI  (via drill 0.35)
  Top 0.508: U1.15 36.47,24.75 37.22,24 v38.94,24 | R4.1 45.76,30.7 43.44,33.02 v43.19,33.02
  Bottom 0.508: v38.94,24 39.53,24 43.19,27.66 v43.19,33.02 43.19,34.04 48.27,39.12 56.65,39.12 58.93,41.4 58.93,45.72 60.12,46.91 ICSP.MOSI
TP2_680/SIGNAL_OUT  (via drill 0.35)
  Top 0.508: v48.01,28.45 48.01,27.6 R3.1 | v43.64,22.99 43.31,22.66 36.67,22.66 35.67,23.66 U1.14
  Bottom 0.508: v48.01,28.45 48.01,27.36 v43.64,22.99
TP3
  Top 0.508: 49.24,36.14 50.19,35.19 R5.2 R6.2 50.19,37.09 49.24,36.14 | 49.24,36.14 46.49,36.14 43.98,35.66 41.92,35.66 U1.25 | TP3.1 ESD_D1.3
  Top 0.61: R5.2 TP3.4 | TP3.4 TP3.3 TP3.2 TP3.1 | R6.2 TP3.4
TP3_470K/SCK  (via drill 0.35)
  Top 0.508: U1.17 39.1,26.94 v39.1,26.24 | v57.66,36.32 54.11,39.88 48.77,39.88 47.35,38.45 R6.1 44.49,37.97 v44.03,37.51
  Bottom 0.508: v39.1,26.24 41.41,28.55 41.41,34.89 v44.03,37.51 | v57.66,36.32 59.7,36.32 66.55,43.18 66.55,45.97 65.62,46.91 ICSP.SCK
TP3_680/MISO  (via drill 0.35)
  Top 0.508: v42.23,24.19 41.29,25.13 38.16,25.13 U1.16 | v45.85,34.29 45.94,34.21 R5.1
  Bottom 0.508: v42.23,24.19 42.2,24.23 45.35,27.38 45.35,33.78 v45.85,34.29 49.35,37.78 58.36,37.78 64.39,43.81 ICSP.MISO
TP_LOGIC
  Top 0.508: R26.2 R25.1 51.91,49.22 52.61,48.52 52.61,45.49 | 52.61,45.49 52.61,45.24 52.7,45.33 54.01,44.02 55.81,44.02 59.66,40.17 59.66,36.29 63.36,32.59 66.3,32.59 67.02,31.86 67.02,30.43 ESD_D1.1 | 52.61,45.49 51.14,44.02 48.09,44.02 43.44,39.37 40.29,39.37 36.47,35.55 U1.26
VBATT_MEASURE  (via drill 0.35)
  Top 0.508: R18.1 20.48,17.1 20.48,24.17 R17.2 22.04,25.19 v24.8,27.94 | U1.27 35.67,36.68 v37.34,38.35
  Bottom 0.508: v24.8,27.94 35.21,38.35 v37.34,38.35
VBOOST  (via drill 0.65)
  Top 0.508: C1.2 15.66,35.61 16.24,35.03 | 16.24,35.03 5V-LDO.1 | 14.81,34.68 14.75,34.68 14.24,34.17 5V-LDO.1 | 5V-LDO.1 16.34,34.77 16.24,34.85 | 5V-LDO.1 15.82,34.17 14.82,34.48 15.09,34.71 | 15.09,34.71 14.91,34.77 | 14.91,34.77 v14.64,34.85 15.55,36.38 | 14.28,34.23 14.41,34.34 14.81,34.68 | 14.81,34.68 14.89,34.76 14.91,34.77 | 5V-LDO.1 C1.2 | 17.2,34.17 17.45,34.42 15.66,36.37 C1.2 | 5V-LDO.1 17.2,34.17 | 15.66,35.76 16.24,35.17 | 16.24,35.17 16.24,35.03 | 16.24,35.17 17.2,34.22 17.2,34.17 | C1.2 15.55,36.38 | 15.55,36.38 14.29,34.39 | 14.28,34.23 14.29,34.39 | 14.28,34.23 15.09,34.71 | 14.28,34.23 C1.2 | C1.2 14.29,34.39
  Top 1.016: C1.2 15.66,35.76 | v14.64,34.85 16.24,34.85 | 14.28,34.23 14.28,29.5 16.21,27.57 CHARGE_BOOST.VO+ | C1.2 15.66,38.57 D3.K | 14.41,34.34 15.66,35.58 C1.2
  Bottom 1.016: POWER-PORT.2 4.51,49.35 5.59,48.26 7.63,48.26 8.9,46.99 8.9,41.66 14.64,35.91 v14.64,34.85
VREF_2.5V
  Top 0.508: R27.2 39.63,44.7 39.63,41.91 38.58,40.86 VREF_SHUNT.1 34.87,37.81 U1.28
VUSB  (via drill 0.2)
  Top 0.508: CHARGE_BOOST.IN+ 8.02,9.37 8.05,9.4 11.44,9.4 v12.71,10.67 | v19.06,12.19 22.39,12.19 D2.2
  Bottom 0.508: v19.06,12.19 17.53,10.67 v12.71,10.67
  Bottom 1.016: POWER-PORT.1 1.71,50.55 1.71,17.6 4.58,14.73 4.58,11.77 CHARGE_BOOST.IN+
XTAL1
  Top 0.508: C6.2 23.98,16.47 23.98,18.9 20MHZ.2 22.2,22.45 26.67,26.92 27.7,26.92 28.96,28.18 30.29,28.18 U1.7
XTAL2
  Top 0.508: U1.8 30.05,27.39 27,24.34 27,20.76 20MHZ.1 27.44,20.32 C7.2

### Text on the board
tPlace: VUSB-VBOOST-5V-GND | VUSB | VBOOST | 5V | GND | VREF_2.5V | OFF ON | POWER / CONTROL
_tPlace: LOGIC_PROBE | PC4/SDA_TP
_bPlace: RESET_TP | TP_POWER_EN | TEST_BUTTON_TP
_tNames: DISPLAY | R25 | R26 | 20MHZ | C11 | C9 | U1 | TP3 | R17 | TP2 | R18 | R19 | TP1 | C13 | C8 | FC1 | C10 | S2 | R21 | S3 | ISP | R7 | R8 | R9 | R20 | POWER-PORT | D3 | D1 | R22 | F1 | S1 | ENC
_bNames: C14_NC | C15_NC | C6 | R23 | R24 | TVS_D2 | C5 | C1 | R6 | R28 | C7 | R5 | 5V-LDO | C2 | R4 | C4 | C3 | R3 | R2 | C12 | R1 | BUZZER | C17 | R10 | C16 | R27 | R13 | VREF_SHUNT | R11 | P1 | R12 | R14 | S4 | R15 | D2 | R16
_bValues: TVS_D1